# EAGLE design BUF_1U_6HP_fpb (EAGLE 6.6.0)
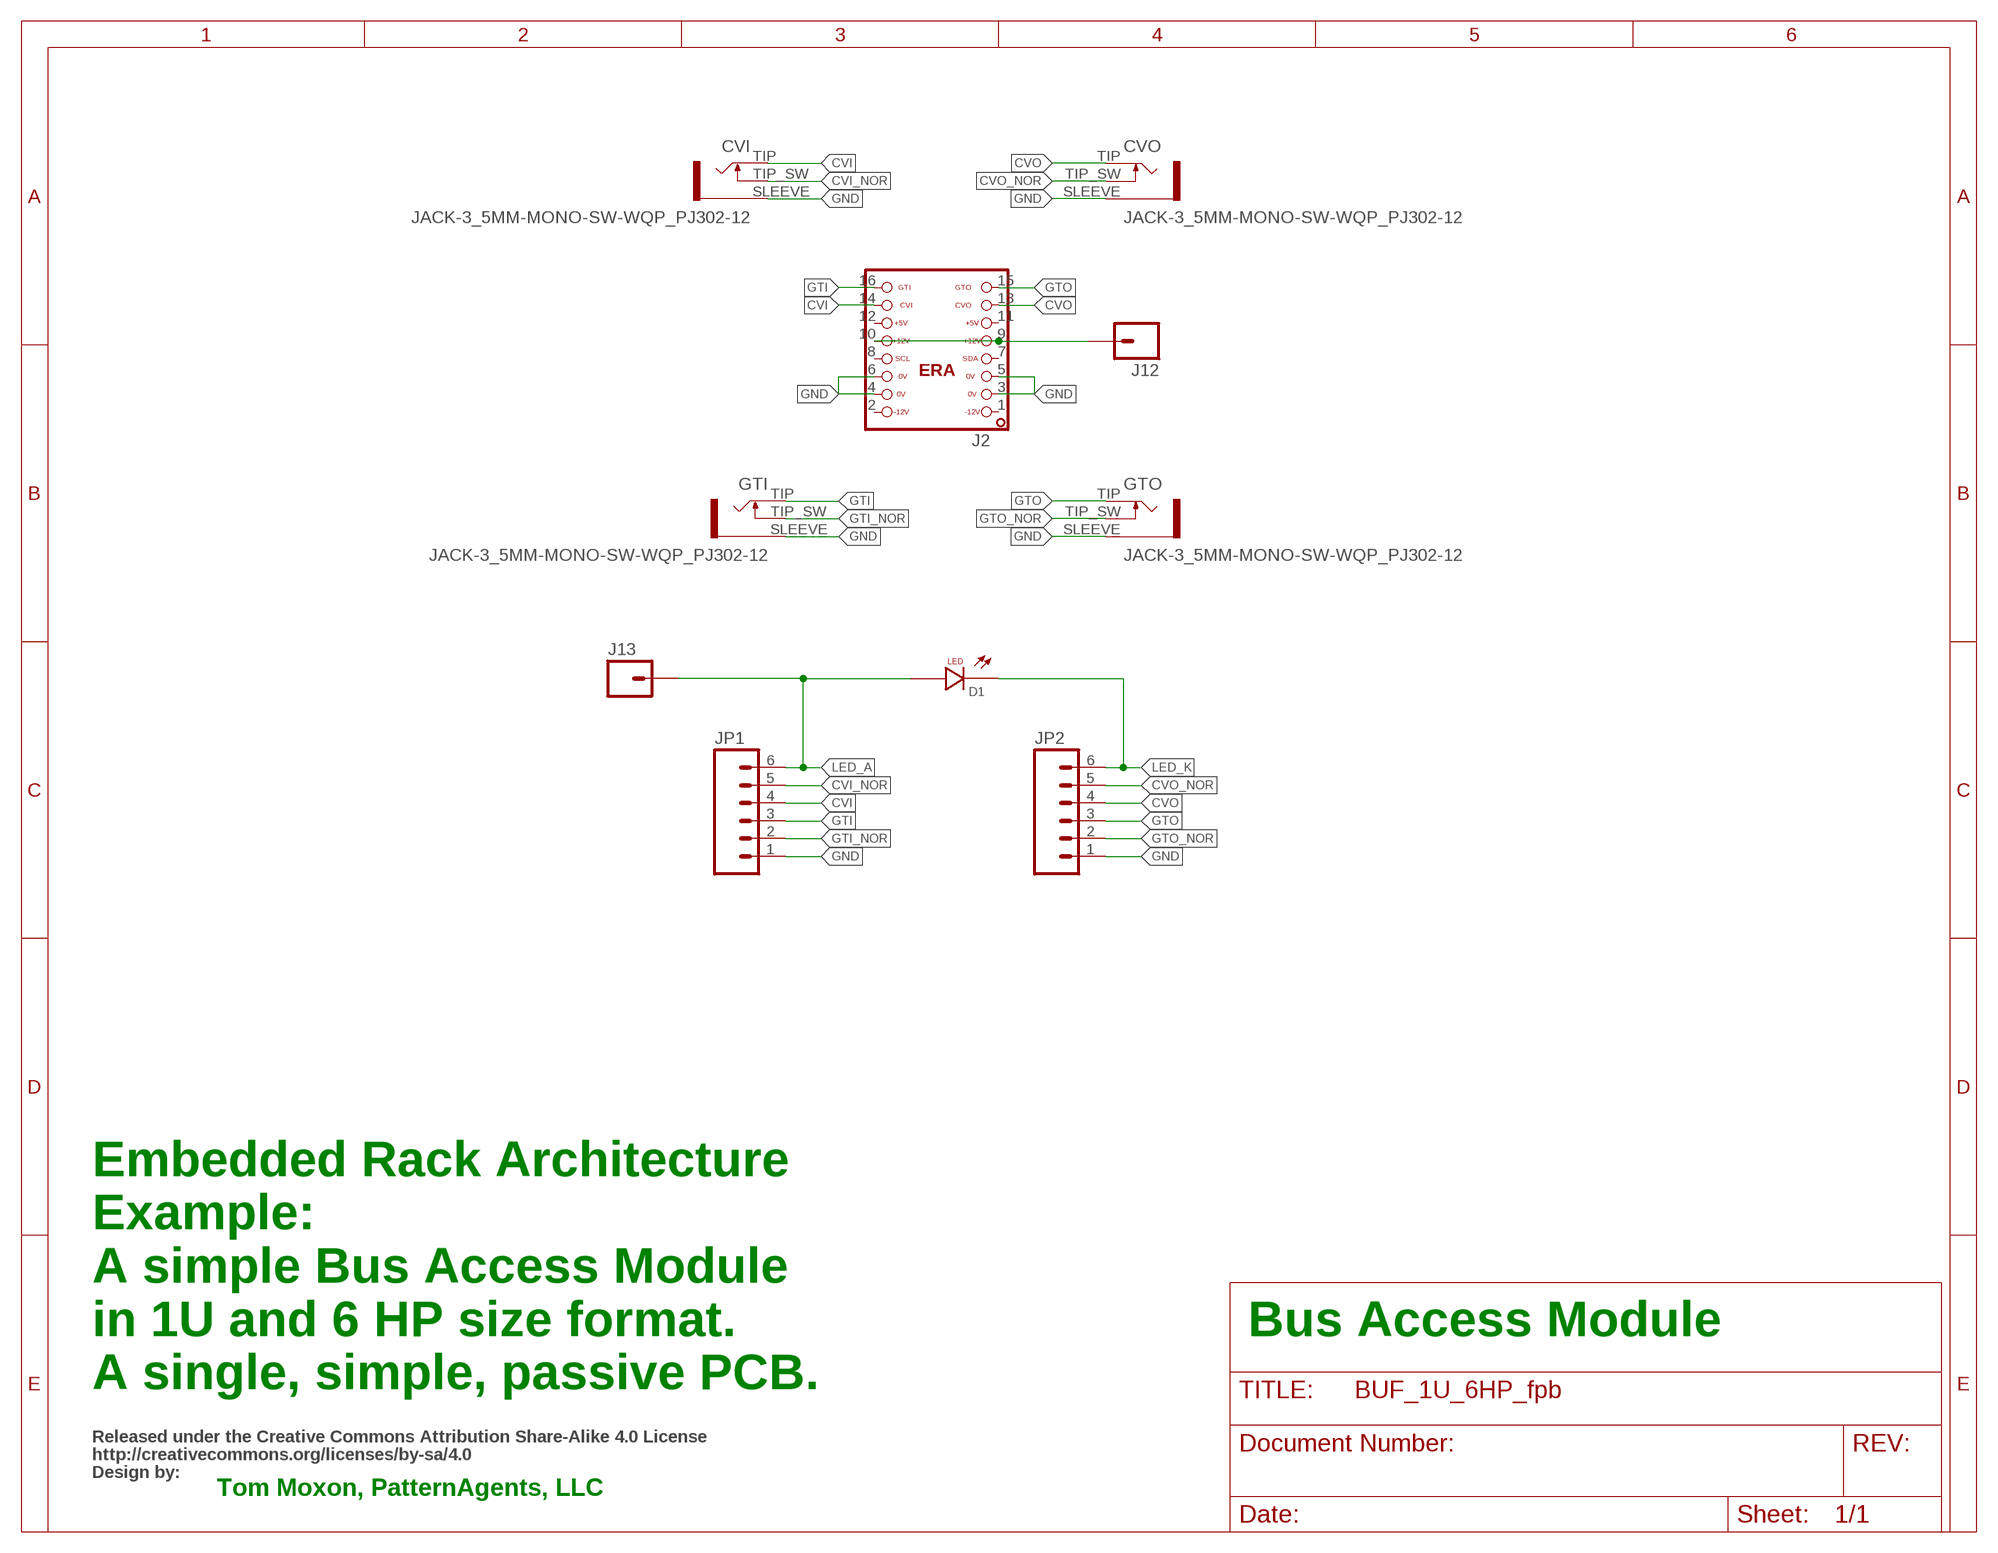
[diagram p0: schematic, sheet 1]

## Parts
CVI  JACK-3_5MM-MONO-SW-WQP_PJ302-12  [WQP_PJ301M-12]
CVO  JACK-3_5MM-MONO-SW-WQP_PJ302-12  [WQP_PJ301M-12]
D1  LED  [LED3MM]
GTI  JACK-3_5MM-MONO-SW-WQP_PJ302-12  [WQP_PJ301M-12]
GTO  JACK-3_5MM-MONO-SW-WQP_PJ302-12  [WQP_PJ301M-12]
J2  ERA-NOSILK  [ERA-NOSILK]
J12  M01PTH  [1X01]
J13  M01PTH  [1X01]
JP1  M06SIP  [1X06]
JP2  M06SIP  [1X06]
TOMMOXON  BY_CC_SA_TEXTNULL  [NULL_SYM]

## Nets
CVI: CVI.TIP J2.14 JP1.4
CVI_NOR: CVI.TIP_SW JP1.5
CVO: CVO.TIP J2.13 JP2.4
CVO_NOR: CVO.TIP_SW JP2.5
GND: CVI.SLEEVE CVO.SLEEVE GTI.SLEEVE GTO.SLEEVE J2.3 J2.4 J2.5 J2.6 JP1.1 JP2.1
GTI: GTI.TIP J2.16 JP1.3
GTI_NOR: GTI.TIP_SW JP1.2
GTO: GTO.TIP J2.15 JP2.3
GTO_NOR: GTO.TIP_SW JP2.2
LED_A: D1.A(ANODE) J13.1 JP1.6
LED_K: D1.K(CATHODE) JP2.6
N$1: J2.9 J2.10 J12.1
Unconnected: J2.1 J2.2 J2.7 J2.8 J2.11 J2.12

## Notes on the sheet
- Bus Access Module
- Embedded Rack Architecture 
  Example:
  A simple Bus Access Module 
  in 1U and 6 HP size format.
  A single, simple, passive PCB.
- Tom Moxon, PatternAgents, LLC

## Library data of the parts
CVI CVO GTI GTO = halcyonmod_Connectors:JACK-3_5MM-MONO-SW: Jack, 3.5mm, RIght Angle, Though-Hole
D1 = halcyonmod_Optoelectronics:LED
J2 = ERA:ERA: EuroRack2 - Backplane Connector
J12 J13 = PatternAgents-ProtoPads:M01: Header 1 Standard 1-pin 0.1" header. Use with straight break away headers (SKU : PRT-00116), right angle break away headers (PRT-00553), swiss pins (PRT-00743), machine pins (PRT-00117), and female headers (PRT-00115). SMTSO-256-ET is a "flush mount" nut for a 4-40 screw. The older package used to be too tight, and did not allow it to sit properly thru the drill hit. The latest (0.165DIA) fits nice and snug.
JP1 JP2 = halcyonmod_Connectors:M06: Header 6 Standard 6-pin 0.1" header. Use with straight break away headers (SKU : PRT-00116), right angle break away headers (PRT-00553), swiss pins (PRT-00743), machine pins (PRT-00117), and female headers (PRT-00115). Molex polarized connector foot print use with SKU : PRT-08094 with associated crimp pins and housings. NOTES ON THE VARIANTS LOCK and LOCK_LONGPADS... This footprint was designed to help hold the alignment of a through-hole component (i.e. 6-pin header) while soldering it into place. You may notice that each hole has been shifted either up or down by 0.005 of an inch from it's more standard position (which is a perfectly straight line). This slight alteration caused the pins (the squares in the middle) to touch the edges of the holes. Because they are alternating, it causes a "brace" to hold the component in place. 0.005 has proven to be the perfect amount of "off-center" position when using our standard breakaway headers. Although looks a little odd when you look at the bare footprint, once you have a header in there, the alteration is very hard to notice. Also, if you push a header all the way into place, it is covered up entirely on the bottom side. This idea of altering the position of holes to aid alignment will be further integrated into the Sparkfun Library for other footprints. It can help hold any component with 3 or more connection pins.
TOMMOXON = PatternAgents-Logos:BY_CC_SA_TEXT: BY_CC_SA_TEXT Source : http://wiki.creativecommons.org/CC_markers Github : https://github.com/PatternAgents/PCB_Libraries License : http://creativecommons.org/licenses/by-sa/4.0/ (Creative Commons 4.0) THIS SOFTWARE IS PROVIDED BY THE CONTRIBUTORS "AS IS" AND WITHOUT ANY EXPRESS OR IMPLIED WARRANTIES, INCLUDING, BUT NOT LIMITED TO, THE IMPLIED WARRANTIES OF MERCHANTABILITY AND FITNESS FOR A PARTICULAR PURPOSE ARE DISCLAIMED. IN NO EVENT SHALL THE COPYRIGHT OWNER OR CONTRIBUTORS BE LIABLE FOR ANY DIRECT, INDIRECT, INCIDENTAL, SPECIAL, EXEMPLARY, OR CONSEQUENTIAL DAMAGES (INCLUDING, BUT NOT LIMITED TO, PROCUREMENT OF SUBSTITUTE GOODS OR SERVICES; LOSS OF USE, DATA, OR PROFITS; OR BUSINESS INTERRUPTION) HOWEVER CAUSED AND ON ANY THEORY OF LIABILITY, WHETHER IN CONTRACT, STRICT LIABILITY, OR TORT (INCLUDING NEGLIGENCE OR OTHERWISE) ARISING IN ANY WAY OUT OF THE USE OF THIS SOFTWARE, EVEN IF ADVISED OF THE POSSIBILITY OF SUCH DAMAGE.

## Board
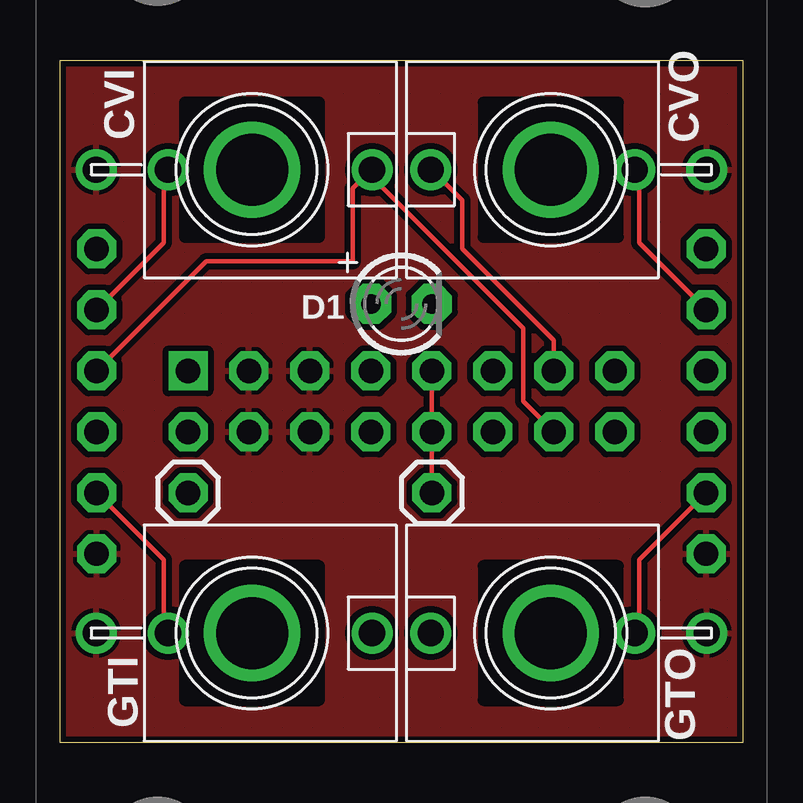
[diagram p1: board, top side]
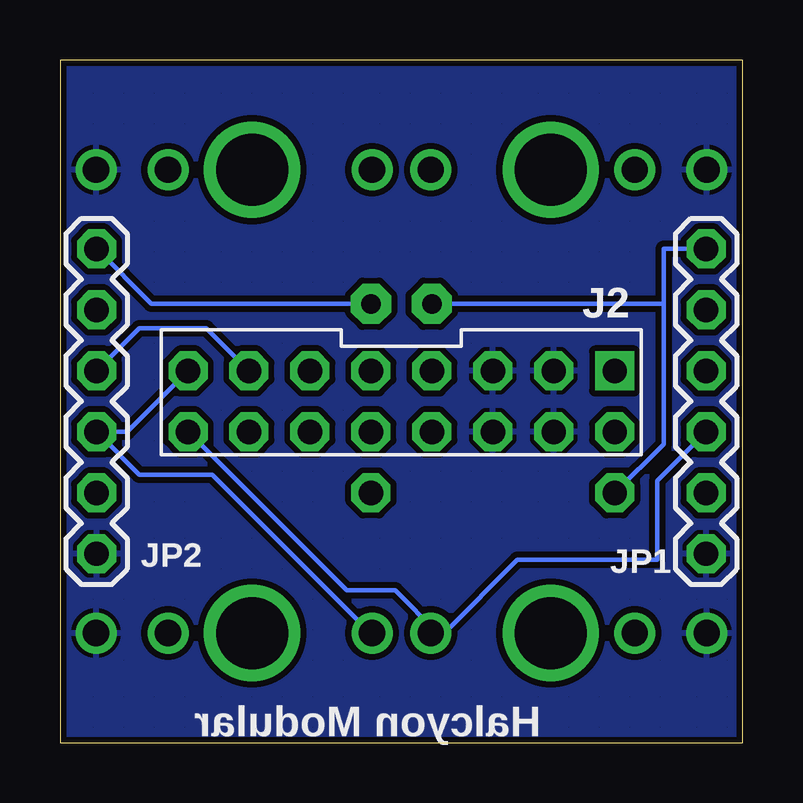
[diagram p2: board, bottom side, seen from below]

Size 28.45 x 28.45 mm. Coordinates in mm from the lower left corner, seen from the top.
Outline: 0,28.45 28.45,28.45 28.45,0 0,0 0,28.45
Copper layers (1*16): Top 0.035mm / dielectric 1.5mm / Bottom 0.035mm
Design rules "PatternAgents_7mil": minimum track width 7mil, minimum drill 14mil, track to track 7mil, track to pad 7mil, pad to pad 7mil, via to via 7mil, smd to smd 7mil, copper to edge 7mil, drill to drill 7mil, minimum pad ring 12mil, minimum via ring 10mil, stop-mask expansion 4mil, vias tented up to drill 25mil, thermal gap 7mil

### Footprints (pad centres in the part's own frame; a part is rotated, then mirrored left to right if it is on the bottom)
WQP_PJ301M-12 = drill 3: HOLE 0,0 | drill 1.1: SLEEVE 0,-6.5; TIP 0,5; TIP_SW 0,-3.5
LED3MM = drill 0.813 pad 1.676 octagon: A -1.27,0; K 1.27,0
ERA-NOSILK = drill 1.016 square: 1 -8.89,-1.27 | drill 1.016 octagon: 2 -8.89,1.27; 3 -6.35,-1.27; 4 -6.35,1.27; 5 -3.81,-1.27; 6 -3.81,1.27; 7 -1.27,-1.27; 8 -1.27,1.27; 9 1.27,-1.27; 10 1.27,1.27; 11 3.81,-1.27; 12 3.81,1.27; 13 6.35,-1.27; 14 6.35,1.27; 15 8.89,-1.27; 16 8.89,1.27
1X01 = drill 1.016 octagon: 1 0,0
1X06 = drill 1.016 octagon: 1 0,0; 2 2.54,0; 3 5.08,0; 4 7.62,0; 5 10.16,0; 6 12.7,0

### Placement (x,y rotation side)
CVI  8,23.88 270 top
CVO  20.45,23.88 90 top
D1  14.22,18.29 0 top
GTI  8,4.57 270 top
GTO  20.45,4.57 90 top
J2  14.22,14.22 180 bottom
J12  15.49,10.41 0 top
J13  5.33,10.41 0 top
JP1  1.52,7.87 90 bottom
JP2  26.92,7.87 90 bottom
TOMMOXON  -1.02,-7.37 0 top  (outside the outline)

### Tracks (layer width: path | path; a pad name or v marks a point on that pad's centre or on a via)
CVI
  Top 0.178: JP1.4 6.1,20.07 12.19,20.07 12.19,23.11 12.95,23.88 CVI.TIP 13.21,23.88 13.21,23.37 19.3,17.27 19.3,14.22 J2.14
CVI_NOR
  Top 0.178: JP1.5 4.32,20.83 4.32,23.88 CVI.TIP_SW
CVO
  Top 0.178: J2.13 20.57,16.76 16.76,20.57 16.76,22.61 15.49,23.88 CVO.TIP
  Bottom 0.178: J2.13 22.35,17.27 25.15,17.27 JP2.4
CVO_NOR
  Top 0.178: JP2.5 24.13,20.83 24.13,23.88 CVO.TIP_SW
GND
  pour Top (isolate 0.254, hatched): 0,28.45 28.45,28.45 28.45,0 0,0
  pour Bottom (isolate 0.254, hatched): 0,28.45 28.45,28.45 28.45,0 0,0
GTI
  Bottom 0.178: JP1.3 3.56,10.92 3.56,7.62 9.4,7.62 12.45,4.57 12.7,4.57 | 12.7,4.57 GTI.TIP 12.95,4.57 | J2.16 16.51,6.35 14.48,6.35 12.7,4.57
GTI_NOR
  Top 0.178: JP1.2 4.32,7.62 4.32,4.57 GTI.TIP_SW
GTO
  Bottom 0.178: J2.15 25.65,12.95 JP2.3 25.15,11.18 22.1,11.18 15.49,4.57 GTO.TIP
GTO_NOR
  Top 0.178: JP2.2 24.13,7.62 24.13,4.57 GTO.TIP_SW
LED_A
  Bottom 0.178: J13.1 3.3,12.45 3.3,18.29 | 3.3,18.29 3.3,20.57 JP1.6 | 3.3,18.29 D1.A
LED_K
  Bottom 0.178: JP2.6 24.64,18.29 D1.K
N$1
  Top 0.178: J12.1 J2.10 J2.9

### Text on the board
bPlace: Halcyon Modular